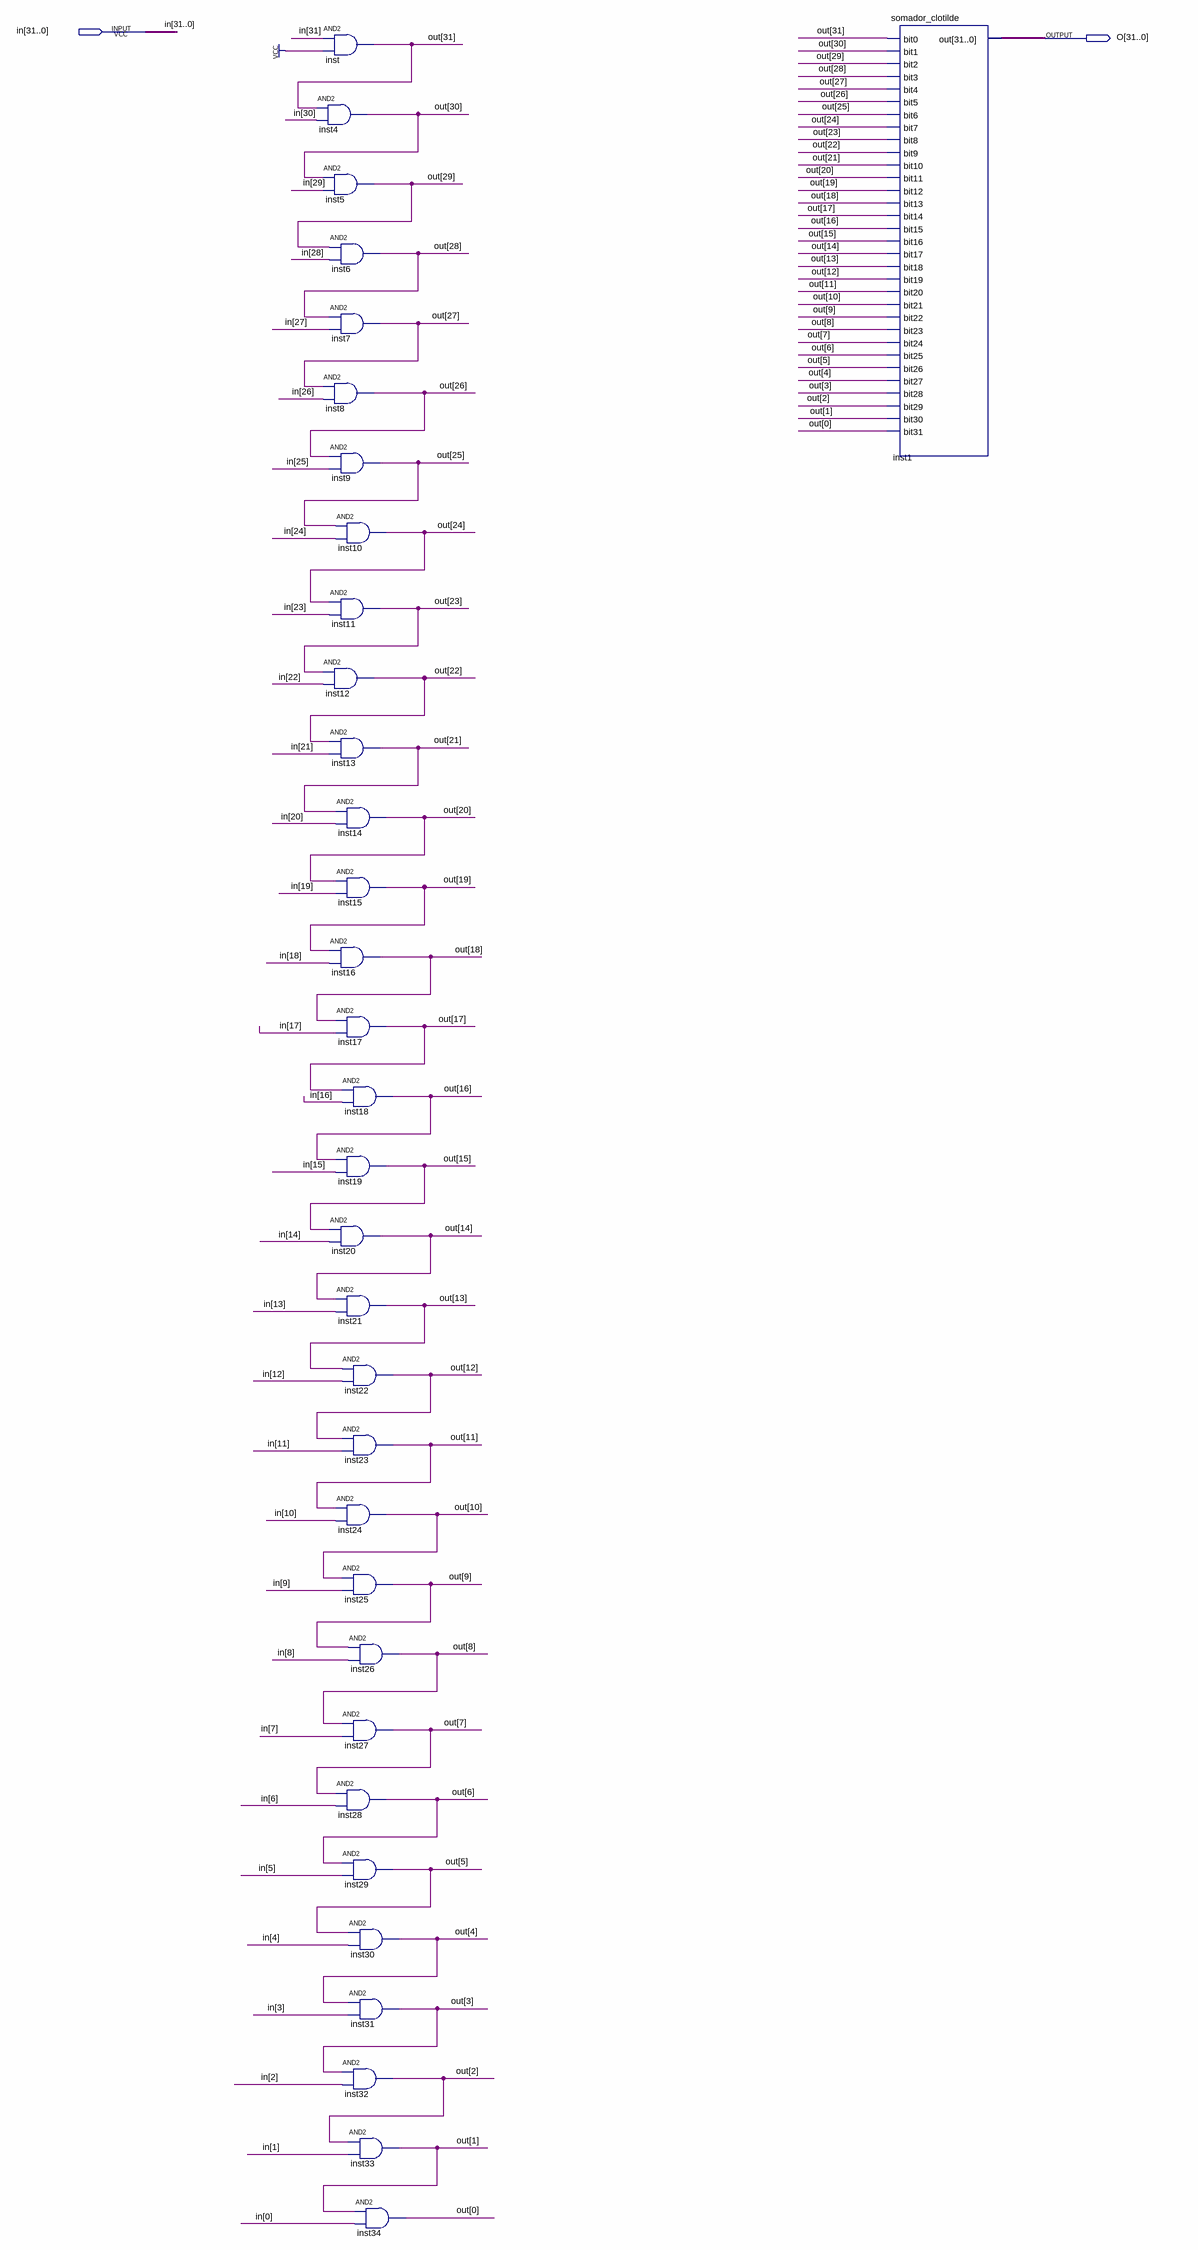
[diagram p0: schematic sheet]
// Quartus schematic clotilde.bdf as structural Verilog: 33 symbols, 2 pins
module clotilde (
  input  [31:0] in,
  output [31:0] O
);

  wire [31:0] out;

  and inst (out[31], in[31], 1'b1);
  and inst4 (out[30], out[31], in[30]);
  and inst5 (out[29], out[30], in[29]);
  and inst6 (out[28], out[29], in[28]);
  and inst7 (out[27], out[28], in[27]);
  and inst8 (out[26], out[27], in[26]);
  and inst9 (out[25], out[26], in[25]);
  and inst10 (out[24], out[25], in[24]);
  and inst11 (out[23], out[24], in[23]);
  and inst12 (out[22], out[23], in[22]);
  and inst13 (out[21], out[22], in[21]);
  and inst14 (out[20], out[21], in[20]);
  and inst15 (out[19], out[20], in[19]);
  and inst16 (out[18], out[19], in[18]);
  and inst17 (out[17], out[18], in[17]);
  and inst18 (out[16], out[17], in[16]);
  and inst19 (out[15], out[16], in[15]);
  and inst20 (out[14], out[15], in[14]);
  and inst21 (out[13], out[14], in[13]);
  and inst22 (out[12], out[13], in[12]);
  and inst23 (out[11], out[12], in[11]);
  and inst24 (out[10], out[11], in[10]);
  and inst25 (out[9], out[10], in[9]);
  and inst26 (out[8], out[9], in[8]);
  and inst27 (out[7], out[8], in[7]);
  and inst28 (out[6], out[7], in[6]);
  and inst29 (out[5], out[6], in[5]);
  and inst30 (out[4], out[5], in[4]);
  and inst31 (out[3], out[4], in[3]);
  and inst32 (out[2], out[3], in[2]);
  and inst33 (out[1], out[2], in[1]);
  and inst34 (out[0], out[1], in[0]);
  somador_clotilde inst1 (
    .bit0(out[31]), .bit1(out[30]), .bit2(out[29]), .bit3(out[28]), .bit4(out[27]), .bit5(out[26]),
    .bit6(out[25]), .bit7(out[24]), .bit8(out[23]), .bit9(out[22]), .bit10(out[21]), .bit11(out[20]),
    .bit12(out[19]), .bit13(out[18]), .bit14(out[17]), .bit15(out[16]), .bit16(out[15]), .bit17(out[14]),
    .bit18(out[13]), .bit19(out[12]), .bit20(out[11]), .bit21(out[10]), .bit22(out[9]), .bit23(out[8]),
    .bit24(out[7]), .bit25(out[6]), .bit26(out[5]), .bit27(out[4]), .bit28(out[3]), .bit29(out[2]),
    .bit30(out[1]), .bit31(out[0]), .out(O));
endmodule
